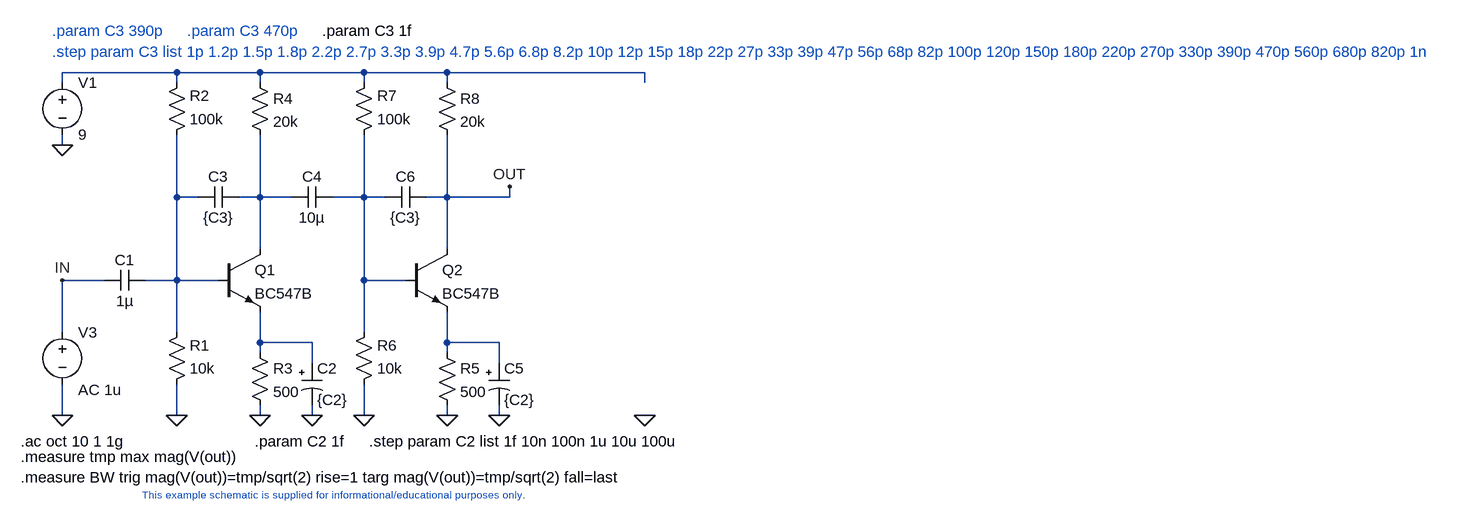
[diagram p0: schematic MeasureBW2.asc]
MeasureBW2.asc, the LTspice schematic file:
Version 4
SHEET 1 2928 1936
WIRE 192 992 16 992
WIRE 320 992 192 992
WIRE 480 992 320 992
WIRE 608 992 480 992
WIRE 912 992 608 992
WIRE 16 1008 16 992
WIRE 192 1008 192 992
WIRE 320 1008 320 992
WIRE 480 1008 480 992
WIRE 608 1008 608 992
WIRE 912 1008 912 992
WIRE 16 1104 16 1088
WIRE 192 1184 192 1088
WIRE 224 1184 192 1184
WIRE 320 1184 320 1088
WIRE 320 1184 288 1184
WIRE 368 1184 320 1184
WIRE 480 1184 480 1088
WIRE 480 1184 432 1184
WIRE 512 1184 480 1184
WIRE 608 1184 608 1088
WIRE 608 1184 576 1184
WIRE 704 1184 704 1168
WIRE 704 1184 608 1184
WIRE 320 1264 320 1184
WIRE 608 1264 608 1184
WIRE 80 1312 16 1312
WIRE 192 1312 192 1184
WIRE 192 1312 144 1312
WIRE 256 1312 192 1312
WIRE 480 1312 480 1184
WIRE 544 1312 480 1312
WIRE 16 1392 16 1312
WIRE 192 1392 192 1312
WIRE 480 1392 480 1312
WIRE 320 1408 320 1360
WIRE 400 1408 320 1408
WIRE 608 1408 608 1360
WIRE 688 1408 608 1408
WIRE 320 1424 320 1408
WIRE 608 1424 608 1408
WIRE 400 1440 400 1408
WIRE 688 1440 688 1408
WIRE 16 1520 16 1472
WIRE 192 1520 192 1472
WIRE 320 1520 320 1504
WIRE 400 1520 400 1504
WIRE 480 1520 480 1472
WIRE 608 1520 608 1504
WIRE 688 1520 688 1504
FLAG 16 1520 0
FLAG 16 1312 IN
FLAG 192 1520 0
FLAG 320 1520 0
FLAG 16 1104 0
FLAG 400 1520 0
FLAG 480 1520 0
FLAG 608 1520 0
FLAG 688 1520 0
FLAG 704 1168 OUT
FLAG 912 1520 0
SYMBOL npn 256 1264 R0
SYMATTR InstName Q1
SYMATTR Value BC547B
SYMBOL res 304 1408 R0
SYMATTR InstName R3
SYMATTR Value 500
SYMBOL voltage 16 1376 R0
WINDOW 123 24 105 Left 2
WINDOW 39 0 0 Left 2
SYMATTR Value2 AC 1u
SYMATTR InstName V3
SYMATTR Value ""
SYMBOL res 176 1488 M180
WINDOW 0 36 76 Left 2
WINDOW 3 36 40 Left 2
SYMATTR InstName R1
SYMATTR Value 10k
SYMBOL cap 144 1296 R90
WINDOW 0 0 32 VBottom 2
WINDOW 3 32 32 VTop 2
SYMATTR InstName C1
SYMATTR Value 1µ
SYMBOL res 176 1104 M180
WINDOW 0 36 76 Left 2
WINDOW 3 36 40 Left 2
SYMATTR InstName R2
SYMATTR Value 100k
SYMBOL voltage 16 992 R0
WINDOW 123 0 0 Left 2
WINDOW 39 0 0 Left 2
SYMATTR InstName V1
SYMATTR Value 9
SYMBOL polcap 384 1440 R0
WINDOW 3 24 56 Left 2
SYMATTR Value {C2}
SYMATTR InstName C2
SYMATTR Description Capacitor
SYMATTR Type cap
SYMBOL res 304 992 R0
SYMATTR InstName R4
SYMATTR Value 20k
SYMBOL cap 288 1168 R90
WINDOW 0 0 32 VBottom 2
WINDOW 3 32 32 VTop 2
SYMATTR InstName C3
SYMATTR Value {C3}
SYMBOL npn 544 1264 R0
SYMATTR InstName Q2
SYMATTR Value BC547B
SYMBOL res 592 1408 R0
SYMATTR InstName R5
SYMATTR Value 500
SYMBOL res 464 1488 M180
WINDOW 0 36 76 Left 2
WINDOW 3 36 40 Left 2
SYMATTR InstName R6
SYMATTR Value 10k
SYMBOL cap 432 1168 R90
WINDOW 0 0 32 VBottom 2
WINDOW 3 32 32 VTop 2
SYMATTR InstName C4
SYMATTR Value 10µ
SYMBOL res 464 1104 M180
WINDOW 0 36 76 Left 2
WINDOW 3 36 40 Left 2
SYMATTR InstName R7
SYMATTR Value 100k
SYMBOL polcap 672 1440 R0
WINDOW 3 24 56 Left 2
SYMATTR Value {C2}
SYMATTR InstName C5
SYMATTR Description Capacitor
SYMATTR Type cap
SYMBOL res 592 992 R0
SYMATTR InstName R8
SYMATTR Value 20k
SYMBOL cap 576 1168 R90
WINDOW 0 0 32 VBottom 2
WINDOW 3 32 32 VTop 2
SYMATTR InstName C6
SYMATTR Value {C3}
TEXT -48 1560 Left 2 !.ac oct 10 1 1g
TEXT 424 1632 Top 1 ;This example schematic is supplied for informational/educational purposes only.
TEXT -48 1584 Left 2 !.measure tmp max mag(V(out))\n.measure BW trig mag(V(out))=tmp/sqrt(2) rise=1 targ mag(V(out))=tmp/sqrt(2) fall=last
TEXT 488 1560 Left 2 !.step param C2 list 1f 10n 100n 1u 10u 100u
TEXT 312 1560 Left 2 !.param C2 1f
TEXT 0 928 Left 2 ;.param C3 390p
TEXT 0 960 Left 2 ;.step param C3 list 1p 1.2p 1.5p 1.8p 2.2p 2.7p 3.3p 3.9p 4.7p 5.6p 6.8p 8.2p 10p 12p 15p 18p 22p 27p 33p 39p 47p 56p 68p 82p 100p 120p 150p 180p 220p 270p 330p 390p 470p 560p 680p 820p 1n
TEXT 208 928 Left 2 ;.param C3 470p
TEXT 416 928 Left 2 !.param C3 1f

The netlist it stands for:
* MeasureBW2.asc
Q1 N003 N002 N005 0 BC547B
R3 N005 0 500
V3 IN 0 AC 1u
R1 0 N002 10k
C1 N002 IN 1µ
R2 N002 N001 100k
V1 N001 0 9
C2 N005 0 {C2}
R4 N001 N003 20k
C3 N003 N002 {C3}
Q2 OUT N004 N006 0 BC547B
R5 N006 0 500
R6 0 N004 10k
C4 N004 N003 10µ
R7 N004 N001 100k
C5 N006 0 {C2}
R8 N001 OUT 20k
C6 OUT N004 {C3}
.model NPN NPN
.model PNP PNP
.lib standard.bjt
.ac oct 10 1 1g
* This example schematic is supplied for informational/educational purposes only.
.measure tmp max mag(V(out))
.measure BW trig mag(V(out))=tmp/sqrt(2) rise=1 targ mag(V(out))=tmp/sqrt(2) fall=last
.step param C2 list 1f 10n 100n 1u 10u 100u
.param C2 1f
* .param C3 390p
* .step param C3 list 1p 1.2p 1.5p 1.8p 2.2p 2.7p 3.3p 3.9p 4.7p 5.6p 6.8p 8.2p 10p 12p 15p 18p 22p 27p 33p 39p 47p 56p 68p 82p 100p 120p 150p 180p 220p 270p 330p 390p 470p 560p 680p 820p 1n
* .param C3 470p
.param C3 1f
.backanno
.end